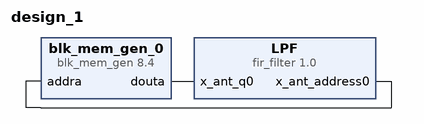
[diagram p0: block diagram of the top level]
# Vivado block design design_1, xc7z010clg400-1, Vivado 2019.2
create_bd_design design_1

create_bd_cell -type ip -vlnv xilinx.com:ip:blk_mem_gen:8.4 blk_mem_gen_0
create_bd_cell -type ip -vlnv xilinx.com:hls:fir_filter:1.0 LPF

# ---- connections ----

connect_bd_net -net fir_filter_0_x_ant_address0 [get_bd_pins LPF/x_ant_address0] [get_bd_pins blk_mem_gen_0/addra]
connect_bd_net [get_bd_pins blk_mem_gen_0/douta] [get_bd_pins LPF/x_ant_q0]

validate_bd_design
save_bd_design
